# Altium schematic sheet E-19 RGB 8x8 Display.SchDoc: RGB 8x8 Display
size B; DrawnBy: Jeremie Boulianne; Organization: Synthiam inc.; Address1: Unit 10, 6120 - 11 St. SE; Address2: Calgary, AB; Address3: T2H 2L7; Address4: Canada; Revision: 0
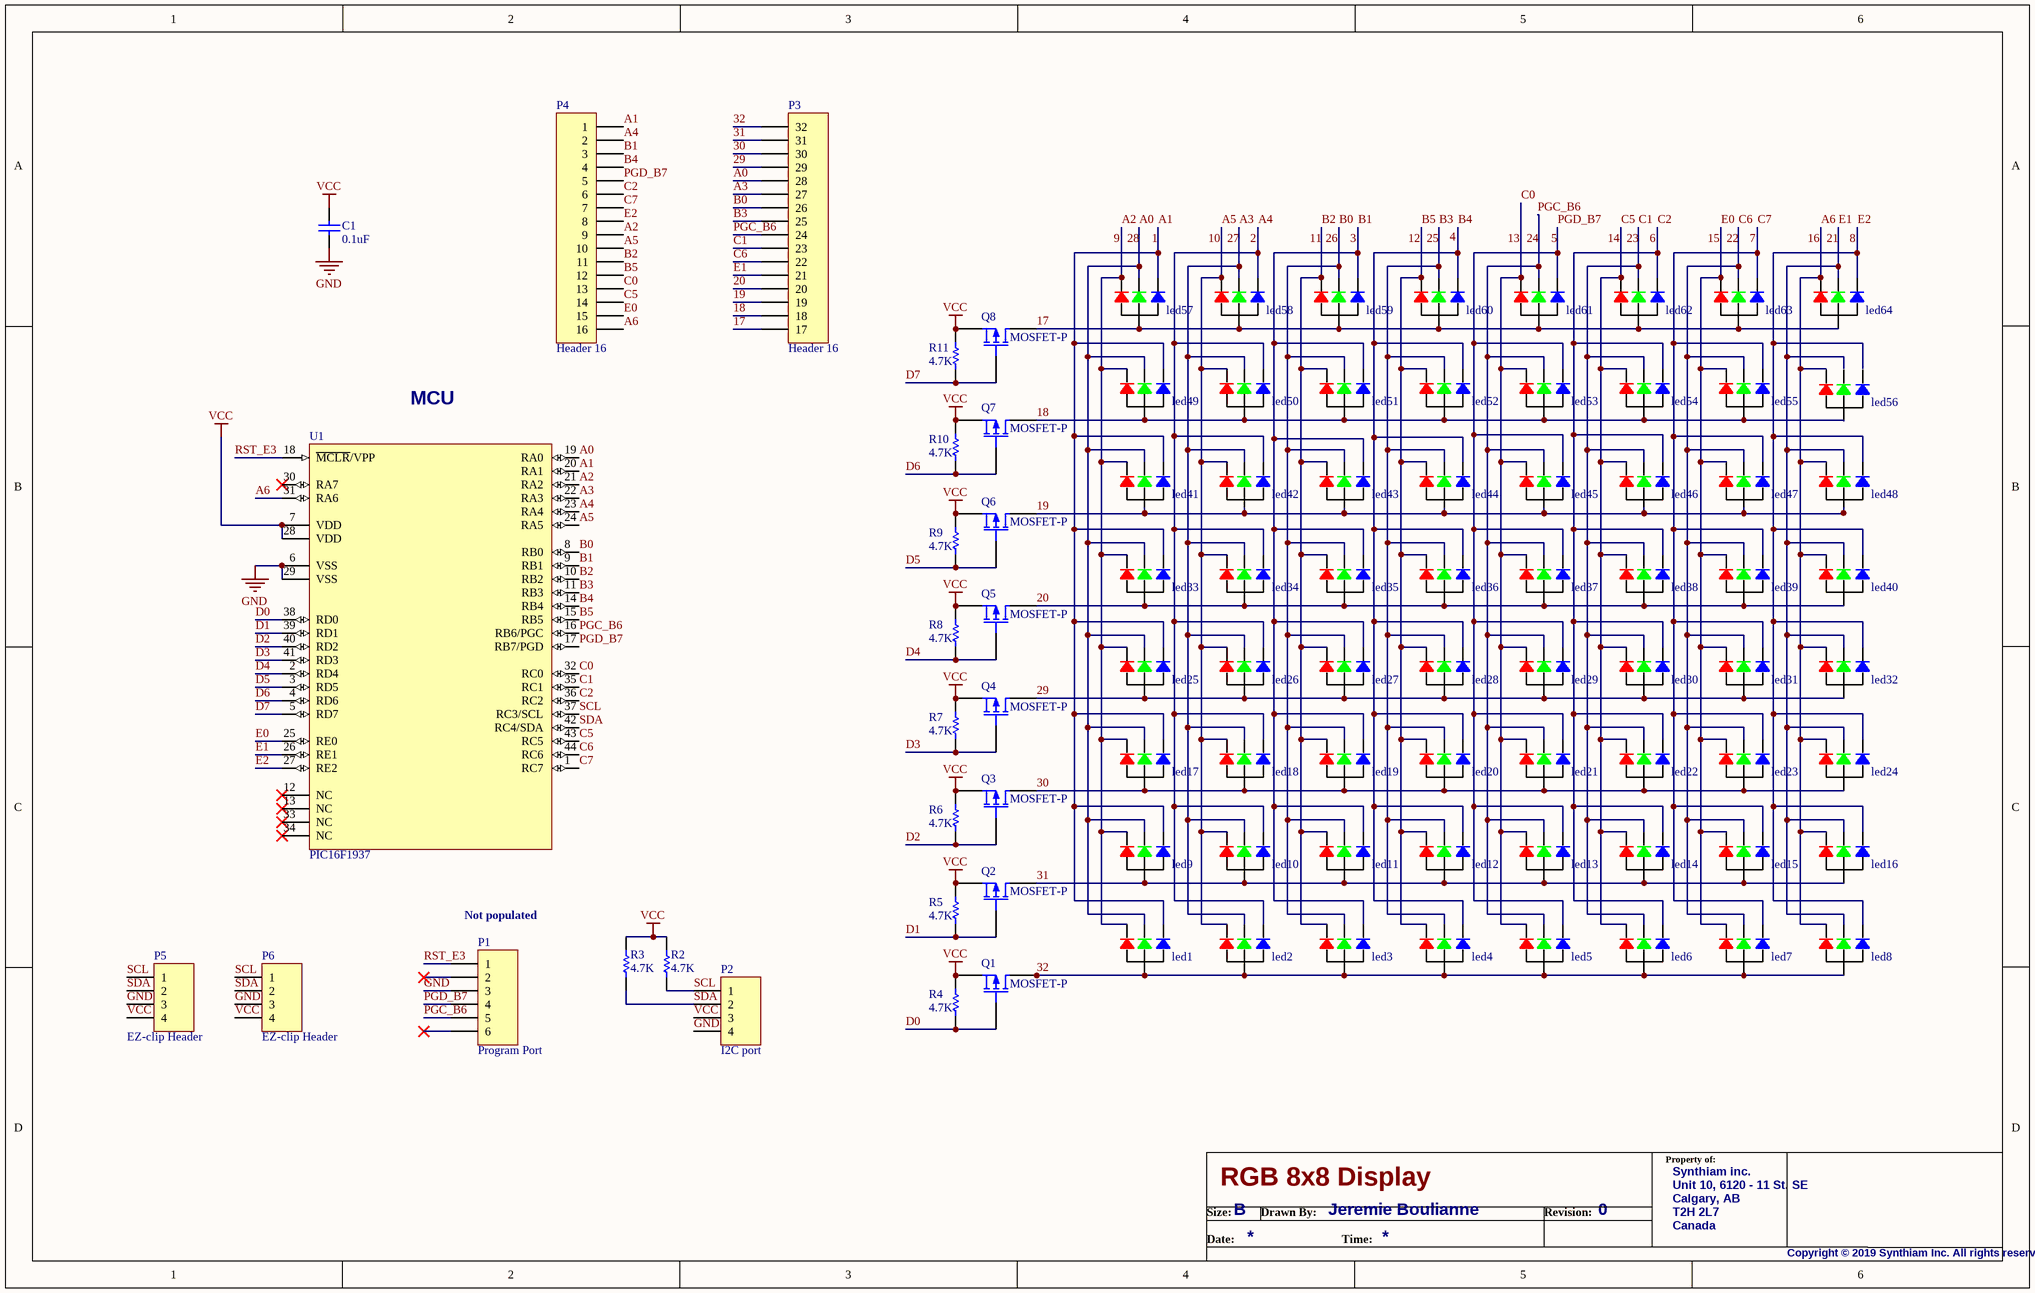
[diagram p0: E-19 RGB 8x8 Display.SchDoc]

## Parts
C1  value 0.1uF  [0805 TIGHT]  (hidden comment: Cap)
led1  RGBLED-CA mini2  (value not drawn)
led2  RGBLED-CA mini2  (value not drawn)
led3  RGBLED-CA mini2  (value not drawn)
led4  RGBLED-CA mini2  (value not drawn)
led5  RGBLED-CA mini2  (value not drawn)
led6  RGBLED-CA mini2  (value not drawn)
led7  RGBLED-CA mini2  (value not drawn)
led8  RGBLED-CA mini2  (value not drawn)
led9  RGBLED-CA mini2  (value not drawn)
led10  RGBLED-CA mini2  (value not drawn)
led11  RGBLED-CA mini2  (value not drawn)
led12  RGBLED-CA mini2  (value not drawn)
led13  RGBLED-CA mini2  (value not drawn)
led14  RGBLED-CA mini2  (value not drawn)
led15  RGBLED-CA mini2  (value not drawn)
led16  RGBLED-CA mini2  (value not drawn)
led17  RGBLED-CA mini2  (value not drawn)
led18  RGBLED-CA mini2  (value not drawn)
led19  RGBLED-CA mini2  (value not drawn)
led20  RGBLED-CA mini2  (value not drawn)
led21  RGBLED-CA mini2  (value not drawn)
led22  RGBLED-CA mini2  (value not drawn)
led23  RGBLED-CA mini2  (value not drawn)
led24  RGBLED-CA mini2  (value not drawn)
led25  RGBLED-CA mini2  (value not drawn)
led26  RGBLED-CA mini2  (value not drawn)
led27  RGBLED-CA mini2  (value not drawn)
led28  RGBLED-CA mini2  (value not drawn)
led29  RGBLED-CA mini2  (value not drawn)
led30  RGBLED-CA mini2  (value not drawn)
led31  RGBLED-CA mini2  (value not drawn)
led32  RGBLED-CA mini2  (value not drawn)
led33  RGBLED-CA mini2  (value not drawn)
led34  RGBLED-CA mini2  (value not drawn)
led35  RGBLED-CA mini2  (value not drawn)
led36  RGBLED-CA mini2  (value not drawn)
led37  RGBLED-CA mini2  (value not drawn)
led38  RGBLED-CA mini2  (value not drawn)
led39  RGBLED-CA mini2  (value not drawn)
led40  RGBLED-CA mini2  (value not drawn)
led41  RGBLED-CA mini2  (value not drawn)
led42  RGBLED-CA mini2  (value not drawn)
led43  RGBLED-CA mini2  (value not drawn)
led44  RGBLED-CA mini2  (value not drawn)
led45  RGBLED-CA mini2  (value not drawn)
led46  RGBLED-CA mini2  (value not drawn)
led47  RGBLED-CA mini2  (value not drawn)
led48  RGBLED-CA mini2  (value not drawn)
led49  RGBLED-CA mini2  (value not drawn)
led50  RGBLED-CA mini2  (value not drawn)
led51  RGBLED-CA mini2  (value not drawn)
led52  RGBLED-CA mini2  (value not drawn)
led53  RGBLED-CA mini2  (value not drawn)
led54  RGBLED-CA mini2  (value not drawn)
led55  RGBLED-CA mini2  (value not drawn)
led56  RGBLED-CA mini2  (value not drawn)
led57  RGBLED-CA mini2  (value not drawn)
led58  RGBLED-CA mini2  (value not drawn)
led59  RGBLED-CA mini2  (value not drawn)
led60  RGBLED-CA mini2  (value not drawn)
led61  RGBLED-CA mini2  (value not drawn)
led62  RGBLED-CA mini2  (value not drawn)
led63  RGBLED-CA mini2  (value not drawn)
led64  RGBLED-CA mini2  (value not drawn)
P1  Program Port  [HDR1X6]
P2  I2C port  [JST-PH 4pin]
P3  Header 16  [HDR1X16]
P4  Header 16  [HDR1X16]
P5  EZ-clip Header  [HDR1X4]
P6  EZ-clip Header  [HDR1X4]
Q1  MOSFET-P  [SOT-23 P-FET]
Q2  MOSFET-P  [SOT-23 P-FET]
Q3  MOSFET-P  [SOT-23 P-FET]
Q4  MOSFET-P  [SOT-23 P-FET]
Q5  MOSFET-P  [SOT-23 P-FET]
Q6  MOSFET-P  [SOT-23 P-FET]
Q7  MOSFET-P  [SOT-23 P-FET]
Q8  MOSFET-P  [SOT-23 P-FET]
R2  value 4.7K  [0805 TIGHT]  (hidden comment: Res1)
R3  value 4.7K  [0805 TIGHT]  (hidden comment: Res1)
R4  value 4.7K  [0805 TIGHT]  (hidden comment: Res1)
R5  value 4.7K  [0805 TIGHT]  (hidden comment: Res1)
R6  value 4.7K  [0805 TIGHT]  (hidden comment: Res1)
R7  value 4.7K  [0805 TIGHT]  (hidden comment: Res1)
R8  value 4.7K  [0805 TIGHT]  (hidden comment: Res1)
R9  value 4.7K  [0805 TIGHT]  (hidden comment: Res1)
R10  value 4.7K  [0805 TIGHT]  (hidden comment: Res1)
R11  value 4.7K  [0805 TIGHT]  (hidden comment: Res1)
U1  PIC16F1937  [TQFP-PT44_M]

## Nets
GND: C1.2 P1.3 P2.4 P5.3 P6.3 U1.6(VSS) U1.29(VSS)
VCC: C1.1 P2.3 P5.4 P6.4 Q1.3(S) Q2.3(S) Q3.3(S) Q4.3(S) Q5.3(S) Q6.3(S) Q7.3(S) Q8.3(S) R2.2 R3.2 R4.2 R5.2 R6.2 R7.2 R8.2 R9.2 R10.2 R11.2 U1.7(VDD) U1.28(VDD)
17: led57.1 led58.1 led59.1 led60.1 led61.1 led62.1 led63.1 led64.1 P3.16(17) Q8.1(D)
18: led49.1 led50.1 led51.1 led52.1 led53.1 led54.1 led55.1 led56.1 P3.15(18) Q7.1(D)
19: led41.1 led42.1 led43.1 led44.1 led45.1 led46.1 led47.1 led48.1 P3.14(19) Q6.1(D)
20: led33.1 led34.1 led35.1 led36.1 led37.1 led38.1 led39.1 led40.1 P3.13(20) Q5.1(D)
29: led25.1 led26.1 led27.1 led28.1 led29.1 led30.1 led31.1 led32.1 P3.4(29) Q4.1(D)
30: led17.1 led18.1 led19.1 led20.1 led21.1 led22.1 led23.1 led24.1 P3.3(30) Q3.1(D)
31: led9.1 led10.1 led11.1 led12.1 led13.1 led14.1 led15.1 led16.1 P3.2(31) Q2.1(D)
32: led1.1 led2.1 led3.1 led4.1 led5.1 led6.1 led7.1 led8.1 P3.1(32) Q1.1(D)
A0: led1.4 led9.4 led17.4 led25.4 led33.4 led41.4 led49.4 led57.4 P3.5(28) U1.19(RA0)
A1: led1.2 led9.2 led17.2 led25.2 led33.2 led41.2 led49.2 led57.2 P4.1 U1.20(RA1)
A2: led1.3 led9.3 led17.3 led25.3 led33.3 led41.3 led49.3 led57.3 P4.9 U1.21(RA2)
A3: led2.4 led10.4 led18.4 led26.4 led34.4 led42.4 led50.4 led58.4 P3.6(27) U1.22(RA3)
A4: led2.2 led10.2 led18.2 led26.2 led34.2 led42.2 led50.2 led58.2 P4.2 U1.23(RA4)
A5: led2.3 led10.3 led18.3 led26.3 led34.3 led42.3 led50.3 led58.3 P4.10 U1.24(RA5)
A6: led8.3 led16.3 led24.3 led32.3 led40.3 led48.3 led64.3 P4.16 U1.31(RA6)
B0: led3.4 led11.4 led19.4 led27.4 led35.4 led43.4 led51.4 led59.4 P3.7(26) U1.8(RB0)
B1: led3.2 led11.2 led19.2 led27.2 led35.2 led43.2 led51.2 led59.2 P4.3 U1.9(RB1)
B2: led3.3 led11.3 led19.3 led27.3 led35.3 led43.3 led51.3 led59.3 P4.11 U1.10(RB2)
B3: led4.4 led12.4 led20.4 led28.4 led36.4 led44.4 led52.4 led60.4 P3.8(25) U1.11(RB3)
B4: led4.2 led12.2 led20.2 led28.2 led36.2 led44.2 led52.2 led60.2 P4.4 U1.14(RB4)
B5: led4.3 led12.3 led20.3 led28.3 led36.3 led44.3 led52.3 led60.3 P4.12 U1.15(RB5)
C0: led5.3 led13.3 led21.3 led29.3 led37.3 led45.3 led53.3 led61.3 P4.13 U1.32(RC0)
C1: led6.4 led14.4 led22.4 led30.4 led38.4 led46.4 led54.4 led62.4 P3.10(23) U1.35(RC1)
C2: led6.2 led14.2 led22.2 led30.2 led38.2 led46.2 led54.2 led62.2 P4.6 U1.36(RC2)
C5: led6.3 led14.3 led22.3 led30.3 led38.3 led46.3 led54.3 led62.3 P4.14 U1.43(RC5)
C6: led7.4 led15.4 led23.4 led31.4 led39.4 led47.4 led55.4 led63.4 P3.11(22) U1.44(RC6)
C7: led7.2 led15.2 led23.2 led31.2 led39.2 led47.2 led55.2 led63.2 P4.7 U1.1(RC7)
D0: Q1.2(G) R4.1 U1.38(RD0)
D1: Q2.2(G) R5.1 U1.39(RD1)
D2: Q3.2(G) R6.1 U1.40(RD2)
D3: Q4.2(G) R7.1 U1.41(RD3)
D4: Q5.2(G) R8.1 U1.2(RD4)
D5: Q6.2(G) R9.1 U1.3(RD5)
D6: Q7.2(G) R10.1 U1.4(RD6)
D7: Q8.2(G) R11.1 U1.5(RD7)
E0: led7.3 led15.3 led23.3 led31.3 led39.3 led47.3 led55.3 led63.3 P4.15 U1.25(RE0)
E1: led8.4 led16.4 led24.4 led32.4 led40.4 led48.4 led64.4 P3.12(21) U1.26(RE1)
E2: led8.2 led16.2 led24.2 led32.2 led40.2 led48.2 led64.2 P4.8 U1.27(RE2)
PGC_B6: led5.4 led13.4 led21.4 led29.4 led37.4 led45.4 led53.4 led61.4 P1.5 P3.9(24) U1.16(RB6/PGC)
PGD_B7: led5.2 led13.2 led21.2 led29.2 led37.2 led45.2 led53.2 led61.2 P1.4 P4.5 U1.17(RB7/PGD)
RST_E3: P1.1 U1.18(~{MCLR}/VPP)
SCL: P2.1 P5.1 P6.1 R2.1 U1.37(RC3/SCL)
SDA: P2.2 P5.2 P6.2 R3.1 U1.42(RC4/SDA)

Not connected (* = marked no-connect by the designer): led56 2 3 4; P1 2* 6*; U1 12(NC)* 13(NC)* 30(RA7)* 33(NC)* 34(NC)*

## Notes on the sheet
- (near U1) MCU
- (near P1) Not populated
- Labels drawn without touching a wire or pin: 1, 2, 3, 4, 5, 6, 7, 8, 9, 10, 11, 12, 13, 14, 15, 16, 21, 22, 23, 24, 25, 26, 27, 28
- Property of:
- Size:
- Date:
- B
- Drawn By:
- Time:
- Revision:
- Copyright © 2019 Synthiam Inc. All rights reserved.

## Library data of the parts
C1 = Cap: Capacitor; Published: 8-Jun-2000; LatestRevisionDate: 17-Jul-2002; LatestRevisionNote: Re-released for DXP Platform.; PackageReference: RAD-0.3; Publisher: Altium Limited
P1 = Header 6: Header, 6-Pin; LatestRevisionDate: 17-Jul-2002; LatestRevisionNote: Re-released for DXP Platform.; Publisher: Altium Limited
P2 P5 P6 = Header 4: Header, 4-Pin; LatestRevisionDate: 17-Jul-2002; LatestRevisionNote: Re-released for DXP Platform.; Publisher: Altium Limited
P3 P4 = Header 16: Header, 16-Pin; LatestRevisionDate: 17-Jul-2002; LatestRevisionNote: Re-released for DXP Platform.; Publisher: Altium Limited
Q1-Q8 = MOSFET-P: P-Channel MOSFET; Published: 8-Jun-2000; LatestRevisionDate: 17-Jul-2002; LatestRevisionNote: Re-released for DXP Platform.; PackageVersion: 1995/1996; PackageReference: E3; Publisher: Altium Limited; PackageDescription: TO, Flat Index; 3 In-Line, Axial Leads; Body Dia. 4.6mm; Lead Dia. 0.5 mm (max)
R2-R11 = Res1: Resistor; Published: 8-Jun-2000; LatestRevisionDate: 17-Jul-2002; LatestRevisionNote: Re-released for DXP Platform.; PackageReference: AXIAL-0.3; Publisher: Altium Limited
U1 = PIC16F1937 - Matrix